# EAGLE design in14-4 (EAGLE 6.2)
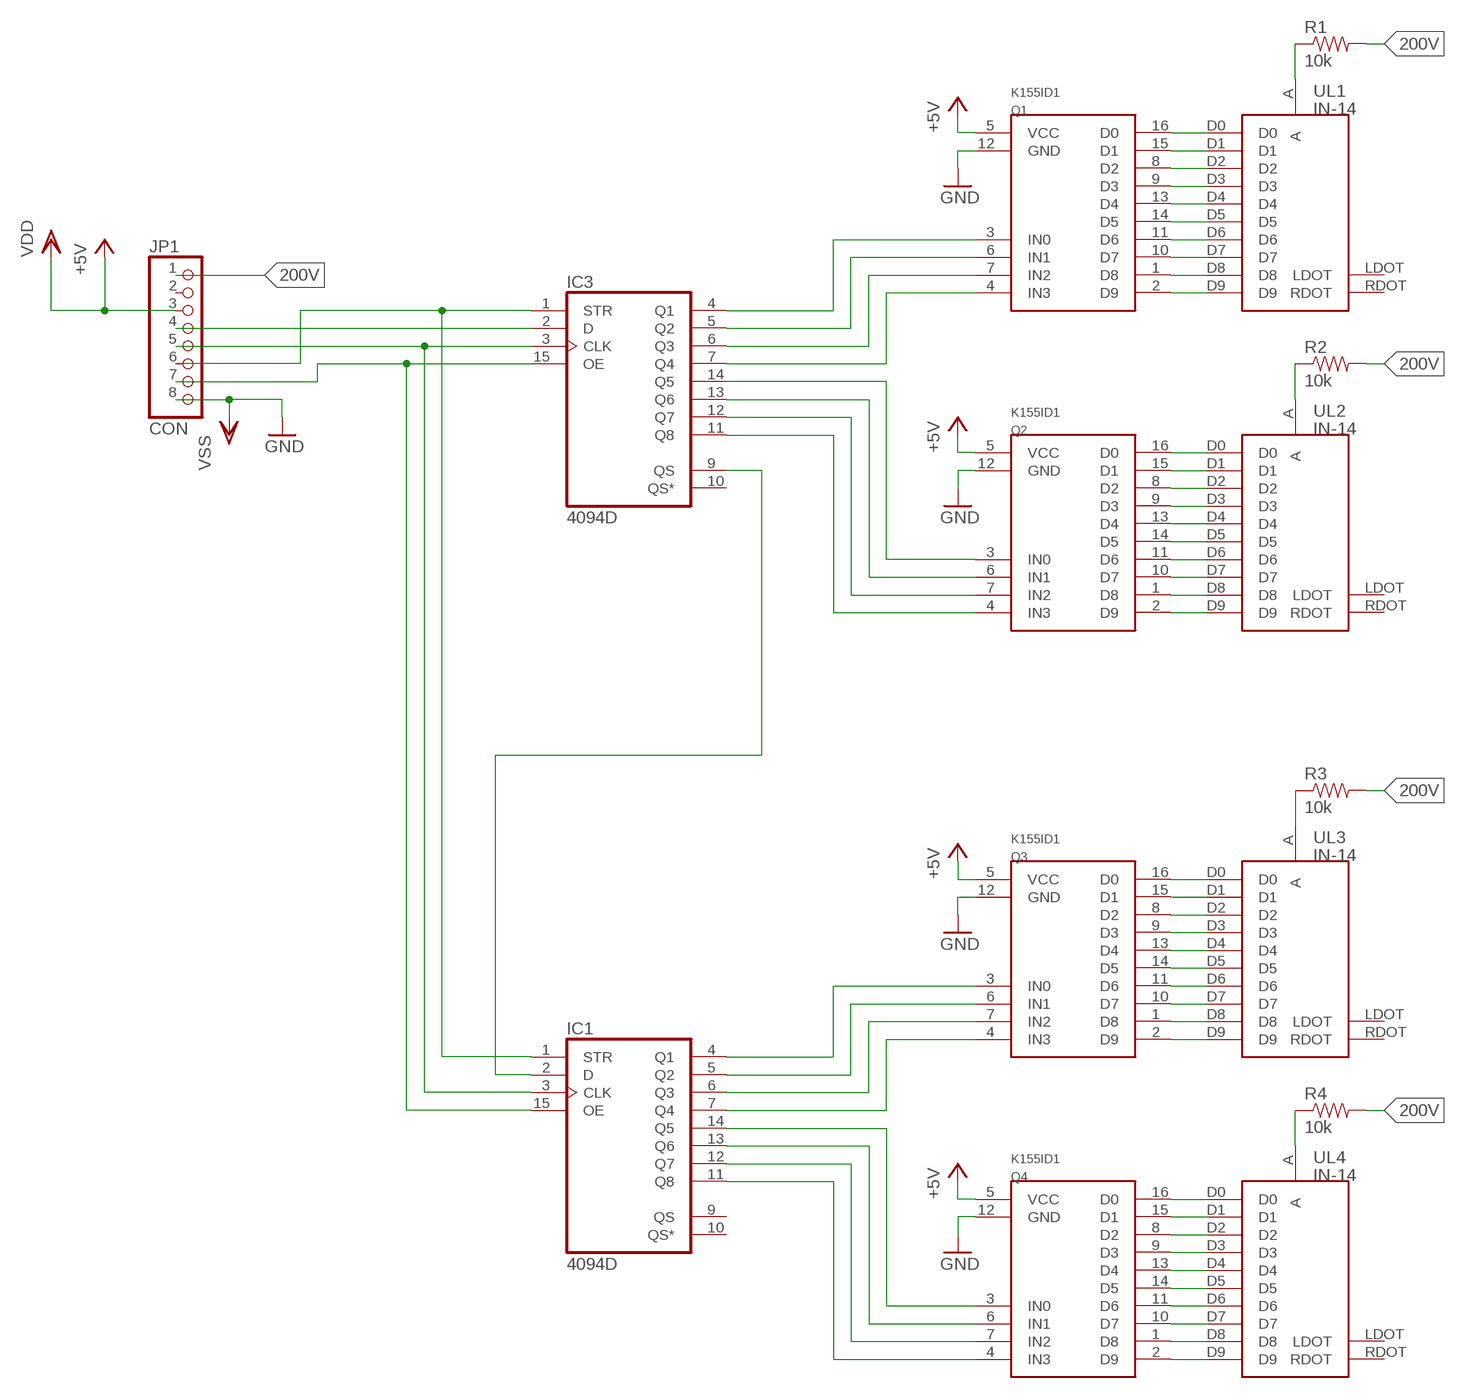
[diagram p0: schematic, sheet 1]

## Parts
IC1  4094D  [SO16]
IC3  4094D  [SO16]
JP1  CON  PINHD-1X8  [1X08]
Q1  K155ID1  [DIL16]
Q2  K155ID1  [DIL16]
Q3  K155ID1  [DIL16]
Q4  K155ID1  [DIL16]
R1  10k  RESISTOR1206  [1206]
R2  10k  RESISTOR1206  [1206]
R3  10k  RESISTOR1206  [1206]
R4  10k  RESISTOR1206  [1206]
UL1  IN-14  [IN-14]
UL2  IN-14  [IN-14]
UL3  IN-14  [IN-14]
UL4  IN-14  [IN-14]

## Nets
200V: JP1.1 R1.2 R2.2 R3.2 R4.2
+5V: JP1.3 Q1.5(VCC) Q2.5(VCC) Q3.5(VCC) Q4.5(VCC) ; supply symbol labelled VDD
GND: JP1.8 Q1.12(GND) Q2.12(GND) Q3.12(GND) Q4.12(GND) ; supply symbol labelled VSS
N$1: Q1.16(D0) UL1.D0
N$2: Q1.15(D1) UL1.D1
N$3: Q1.8(D2) UL1.D2
N$4: Q1.9(D3) UL1.D3
N$5: Q1.13(D4) UL1.D4
N$6: Q1.14(D5) UL1.D5
N$7: Q1.11(D6) UL1.D6
N$8: Q1.10(D7) UL1.D7
N$9: Q1.1(D8) UL1.D8
N$10: Q1.2(D9) UL1.D9
N$11: R1.1 UL1.A
N$12: Q2.16(D0) UL2.D0
N$13: Q2.15(D1) UL2.D1
N$14: Q2.8(D2) UL2.D2
N$15: Q2.9(D3) UL2.D3
N$16: Q2.13(D4) UL2.D4
N$17: Q2.14(D5) UL2.D5
N$18: Q2.11(D6) UL2.D6
N$19: Q2.10(D7) UL2.D7
N$20: Q2.1(D8) UL2.D8
N$21: Q2.2(D9) UL2.D9
N$22: R2.1 UL2.A
N$23: Q3.2(D9) UL3.D9
N$24: IC3.5(Q2) Q1.6(IN1)
N$25: Q3.11(D6) UL3.D6
N$28: IC3.13(Q6) Q2.6(IN1)
N$29: IC3.12(Q7) Q2.7(IN2)
N$30: IC3.11(Q8) Q2.4(IN3)
N$31: IC3.2(D) JP1.4
N$32: IC1.3(CLK) IC3.3(CLK) JP1.5
N$33: IC1.1(STR) IC3.1(STR) JP1.6
N$34: IC1.15(OE) IC3.15(OE) JP1.7
N$35: IC1.7(Q4) Q3.4(IN3)
N$36: IC1.6(Q3) Q3.7(IN2)
N$37: IC1.5(Q2) Q3.6(IN1)
N$38: IC1.4(Q1) Q3.3(IN0)
N$39: IC1.14(Q5) Q4.3(IN0)
N$40: IC1.13(Q6) Q4.6(IN1)
N$41: IC1.12(Q7) Q4.7(IN2)
N$42: IC1.11(Q8) Q4.4(IN3)
N$43: Q3.16(D0) UL3.D0
N$44: Q3.15(D1) UL3.D1
N$45: Q3.8(D2) UL3.D2
N$46: Q3.9(D3) UL3.D3
N$47: Q3.13(D4) UL3.D4
N$48: Q3.14(D5) UL3.D5
N$50: Q3.10(D7) UL3.D7
N$51: Q3.1(D8) UL3.D8
N$53: Q4.16(D0) UL4.D0
N$54: Q4.15(D1) UL4.D1
N$55: Q4.8(D2) UL4.D2
N$56: Q4.9(D3) UL4.D3
N$57: Q4.13(D4) UL4.D4
N$58: Q4.14(D5) UL4.D5
N$59: Q4.11(D6) UL4.D6
N$60: Q4.10(D7) UL4.D7
N$61: Q4.1(D8) UL4.D8
N$62: Q4.2(D9) UL4.D9
N$63: IC3.4(Q1) Q1.3(IN0)
N$64: R3.1 UL3.A
N$65: R4.1 UL4.A
N$67: IC1.2(D) IC3.9(QS)
N$68: IC3.7(Q4) Q1.4(IN3)
N$69: IC3.6(Q3) Q1.7(IN2)
N$70: IC3.14(Q5) Q2.3(IN0)
Unconnected: IC1.9(QS) IC1.10(QS*) IC3.10(QS*) JP1.2 UL1.LDOT UL1.RDOT UL2.LDOT UL2.RDOT UL3.LDOT UL3.RDOT UL4.LDOT UL4.RDOT

## Power pins joined to a net without a drawn wire
+5V: IC1.16(VDD) IC3.16(VDD)
GND: IC1.8(VSS) IC3.8(VSS)

## Library data of the parts
IC1 IC3 = 40xx:4094: 8-stage SHIFT/STORE REGISTER, tri-state
JP1 = pinhead:PINHD-1X8: PIN HEADER
Q1-Q4 = nixie:K155ID1
R1-R4 = SparkFun-Passives:RESISTOR: Resistor Basic schematic elements and footprints for 0603, 1206, and PTH resistors.
UL1-UL4 = nixie:IN-14

## Board
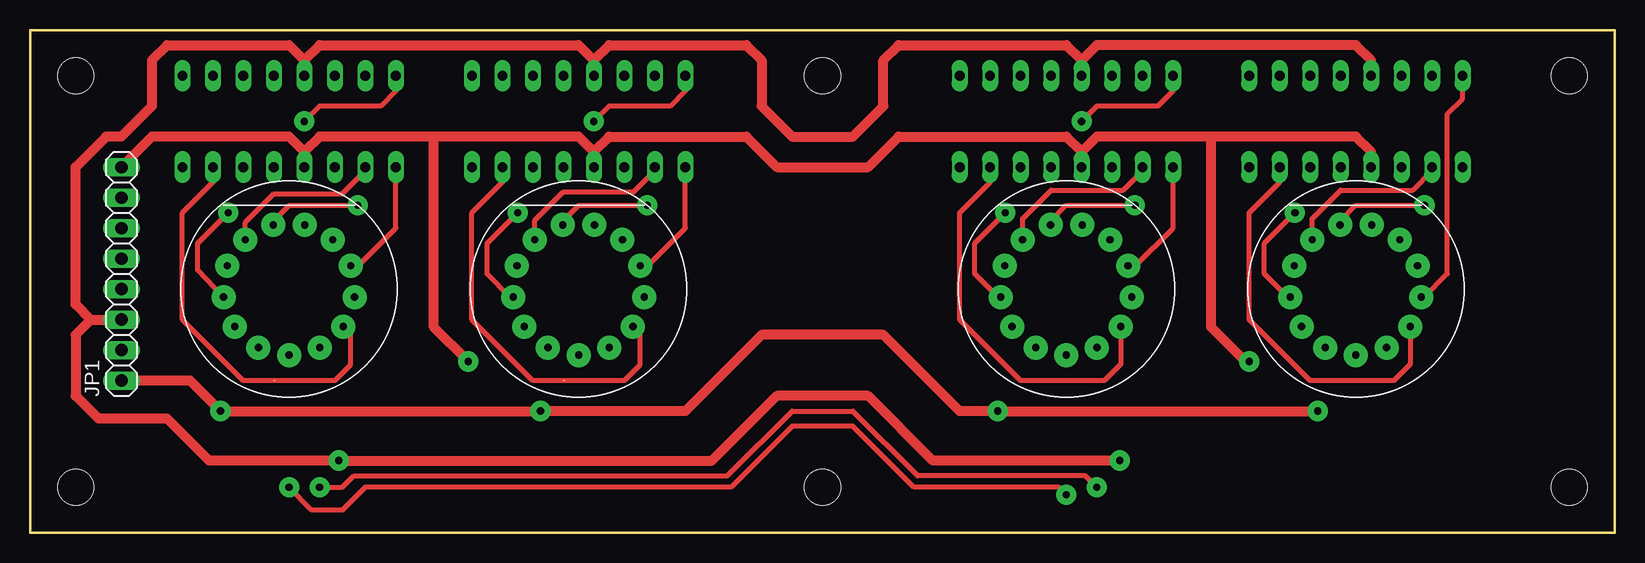
[diagram p1: board, top side]
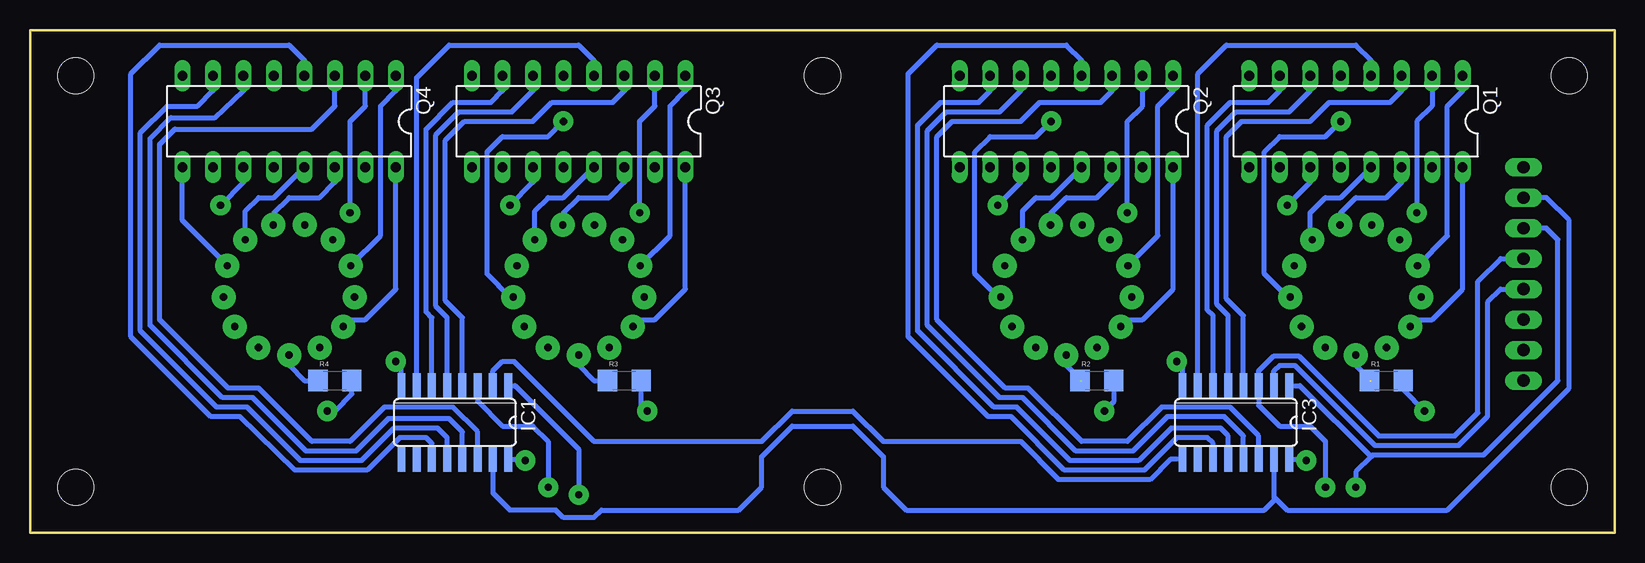
[diagram p2: board, bottom side, seen from below]

Size 132.08 x 41.91 mm. Coordinates in mm from the lower left corner, seen from the top.
Outline: 0,0 132.08,0 132.08,41.91 0,41.91 0,0
Copper layers (1*16): Top 0.035mm / dielectric 1.5mm / Bottom 0.035mm
Design rules: minimum track width 10mil, minimum drill 24mil, track to track 8mil, track to pad 8mil, pad to pad 8mil, via to via 8mil, smd to smd 8mil, copper to edge 40mil, drill to drill 8mil, minimum pad ring 10mil, minimum via ring 8mil, stop-mask expansion 4mil, vias tented up to drill 0mil, thermal gap 10mil
Holes 3 mm at 3.81,38.1 128.27,38.1 128.27,3.81 3.81,3.81 66.04,38.1 66.04,3.81

### Footprints (pad centres in the part's own frame; a part is rotated, then mirrored left to right if it is on the bottom)
SO16 = smd 0.66 x 2.032: 1 -4.445,-3.073; 2 -3.175,-3.073; 3 -1.905,-3.073; 4 -0.635,-3.073; 5 0.635,-3.073; 6 1.905,-3.073; 7 3.175,-3.073; 8 4.445,-3.073; 9 4.445,3.073; 10 3.175,3.073; 11 1.905,3.073; 12 0.635,3.073; 13 -0.635,3.073; 14 -1.905,3.073; 15 -3.175,3.073; 16 -4.445,3.073
1X08 = drill 1.016 long: 1 -8.89,0; 2 -6.35,0; 3 -3.81,0; 4 -1.27,0; 5 1.27,0; 6 3.81,0; 7 6.35,0; 8 8.89,0
DIL16 = drill 0.813 long: 1 -8.89,-3.81; 2 -6.35,-3.81; 3 -3.81,-3.81; 4 -1.27,-3.81; 5 1.27,-3.81; 6 3.81,-3.81; 7 6.35,-3.81; 8 8.89,-3.81; 9 8.89,3.81; 10 6.35,3.81; 11 3.81,3.81; 12 1.27,3.81; 13 -1.27,3.81; 14 -3.81,3.81; 15 -6.35,3.81; 16 -8.89,3.81
1206 = smd 1.6 x 1.8: 1 -1.4,0; 2 1.4,0
IN-14 = drill 0.6 pad 2: A 0,5.5; D0 4.526,3.124; D1 -4.526,3.124; D2 -5.46,0.663; D3 -5.143,-1.95; D4 -3.647,-4.117; D5 -1.316,-5.34; D6 1.316,-5.34; D7 3.647,-4.117; D8 5.143,-1.95; D9 5.46,0.663; LDOT -2.556,4.87; RDOT 2.556,4.87

### Placement (x,y rotation side)
IC1  96.68,9.21 180 bottom
IC3  31.59,9.21 180 bottom
JP1  7.62,21.59 90 top
Q1  21.59,34.29 180 bottom
Q2  45.72,34.29 180 bottom
Q3  86.36,34.29 180 bottom
Q4  110.49,34.29 180 bottom
R1  19.05,12.7 0 bottom
R2  43.18,12.7 0 bottom
R3  82.55,12.7 0 bottom
R4  106.68,12.7 0 bottom
UL1  21.59,20.32 180 top
UL2  45.72,20.32 180 top
UL3  86.36,20.32 180 top
UL4  110.49,20.32 180 top

### Tracks (layer width: path | path; a pad name or v marks a point on that pad's centre or on a via)
200V  (via drill 0.6 pad 1.68)
  Top 0.813: v107.31,10.16 v80.64,10.16 77.47,10.16 71.12,16.51 60.96,16.51 54.61,10.16 v42.55,10.16 v15.88,10.16 13.34,12.7 JP1.1
  Bottom 0.406: 16.36,10.64 v15.88,10.16 17.65,11.94 R1.2 | v80.64,10.16 81.13,10.64 81.15,10.64 R3.2 | v107.31,10.16 106.68,10.16 105.26,11.58 105.28,11.58 R4.2 | R2.2 41.78,10.93 v42.55,10.16
+5V  (via drill 0.6 pad 1.68)
  Top 0.813: Q1.5 22.86,39.37 | 22.86,39.37 24.13,40.64 45.72,40.64 46.99,39.37 | 46.99,39.37 Q2.5 | Q3.5 87.63,39.37 | 87.63,39.37 86.36,40.64 72.39,40.64 71.12,39.37 71.12,35.56 68.58,33.02 63.5,33.02 60.96,35.56 60.96,39.37 59.69,40.64 48.26,40.64 46.99,39.37 | Q4.5 111.76,39.37 110.49,40.64 88.9,40.64 87.63,39.37 | 5.08,17.78 3.81,19.05 3.81,30.48 6.35,33.02 7.62,33.02 10.16,35.56 10.16,39.37 11.43,40.64 21.59,40.64 22.86,39.37 | 5.08,17.78 3.81,16.51 3.81,11.43 5.71,9.53 11.43,9.53 14.92,6.03 v25.72,6.03 56.83,6.03 62.23,11.43 69.85,11.43 75.25,6.03 v90.81,6.03 | 5.08,17.78 JP1.3
  Bottom 0.406: IC3.16 25.82,6.13 v25.72,6.03 | IC1.16 90.91,6.13 v90.81,6.03
GND  (via drill 0.6 pad 1.68)
  Top 0.813: 22.86,31.75 21.59,33.02 10.16,33.02 JP1.8 | 22.86,31.75 Q1.12 | Q2.12 46.99,31.75 | 46.99,31.75 45.72,33.02 33.66,33.02 | 33.66,33.02 24.13,33.02 22.86,31.75 | Q3.12 87.63,31.75 | 87.63,31.75 86.36,33.02 72.39,33.02 69.85,30.48 62.23,30.48 59.69,33.02 48.26,33.02 46.99,31.75 | v36.51,14.29 33.66,17.14 33.66,33.02 | Q4.12 111.76,31.75 110.49,33.02 98.42,33.02 | 98.42,33.02 88.9,33.02 87.63,31.75 | v101.6,14.29 101.28,14.29 98.42,17.14 98.42,33.02
  Bottom 0.406: IC1.8 101.12,13.81 v101.6,14.29 | IC3.8 36.04,13.81 v36.51,14.29
N$1
  Bottom 0.406: UL1.D0 16.48,17.78 15.24,17.78 12.7,20.32 Q1.16
N$2
  Top 0.406: UL1.D1 26.67,16.64 26.67,13.97 25.4,12.7 17.78,12.7 12.7,17.78 12.7,26.67 15.24,29.21 Q1.15
N$3  (via drill 0.6 pad 1.68)
  Top 0.406: Q1.8 30.48,36.83 29.21,35.56 24.13,35.56 v22.86,34.29
  Bottom 0.406: UL1.D2 27.28,19.66 29.21,21.59 29.21,31.75 27.94,33.02 24.13,33.02 v22.86,34.29
N$4
  Top 0.406: UL1.D3 27.35,22.27 30.48,25.4 Q1.9
N$5
  Bottom 0.406: UL1.D4 25.4,24.6 25.4,26.67 24.13,27.94 22.86,27.94 Q1.13
N$6
  Bottom 0.406: UL1.D5 22.86,25.71 22.86,26.67 21.59,27.94 19.05,27.94 17.78,29.21 Q1.14
N$7  (via drill 0.6 pad 1.68)
  Top 0.406: UL1.D6 20.27,25.99 21.59,27.3 v27.3,27.3
  Bottom 0.406: Q1.11 25.4,29.21 v27.3,27.3
N$8
  Top 0.406: UL1.D7 17.94,25.88 20.32,28.26 26.04,28.26 27.94,30.16 Q1.10
N$9
  Bottom 0.406: UL1.D8 13.97,24.75 13.97,35.56 12.7,36.83 Q1.1
N$10  (via drill 0.6 pad 1.68)
  Top 0.406: UL1.D9 13.97,21.93 13.97,22.86 13.97,24.13 v16.51,26.67
  Bottom 0.406: Q1.2 15.24,35.56 16.51,34.29 v16.51,26.67
N$11  (1 unrouted)
  Bottom 0.406: UL1.A 21.59,13.97 20.32,12.7
N$12
  Bottom 0.406: UL2.D0 41.19,17.23 40.64,17.78 39.37,17.78 36.83,20.32 Q2.16
N$13
  Top 0.406: UL2.D1 50.25,17.06 50.8,16.51 50.8,13.97 49.53,12.7 41.91,12.7 36.83,17.78 36.83,26.67 39.37,29.21 Q2.15
N$14  (via drill 0.6 pad 1.68)
  Top 0.406: Q2.8 54.61,36.83 53.34,35.56 48.26,35.56 v46.99,34.29
  Bottom 0.406: UL2.D2 51.41,19.66 53.34,21.59 53.34,31.75 52.07,33.02 48.26,33.02 v46.99,34.29
N$15
  Top 0.406: UL2.D3 51.48,22.27 54.61,25.4 Q2.9
N$16
  Bottom 0.406: UL2.D4 49.37,26.83 48.26,27.94 46.99,27.94 Q2.13
N$17
  Bottom 0.406: UL2.D5 47.04,26.62 45.72,27.94 43.18,27.94 41.91,29.21 Q2.14
N$18  (via drill 0.6 pad 1.68)
  Top 0.406: UL2.D6 44.4,25.99 45.72,27.3 v51.44,27.3
  Bottom 0.406: Q2.11 49.53,29.21 v51.44,27.3
N$19
  Top 0.406: UL2.D7 42.07,26.04 44.45,28.42 50.32,28.42 52.07,30.16 Q2.10
N$20
  Bottom 0.406: UL2.D8 40.58,22.29 38.1,24.77 38.1,35.56 36.83,36.83 Q2.1
N$21  (via drill 0.6 pad 1.68)
  Top 0.406: UL2.D9 40.03,19.66 38.1,21.59 38.1,24.13 v40.64,26.67
  Bottom 0.406: v40.64,26.67 40.64,34.29 39.37,35.56 Q2.2
N$22  (1 unrouted)
  Bottom 0.406: UL2.A 45.72,13.97 44.45,12.7
N$23  (via drill 0.6 pad 1.68)
  Top 0.406: UL3.D9 80.67,19.66 78.74,21.59 78.74,24.13 v81.28,26.67
  Bottom 0.406: v81.28,26.67 81.28,34.29 80.01,35.56 Q3.2
N$24
  Bottom 0.406: IC3.5 32.23,18.1 33.18,19.05 33.18,33.5 31.59,35.08 27.15,35.08 25.4,36.83 Q1.6
N$25  (via drill 0.6 pad 1.68)
  Top 0.406: UL3.D6 85.04,25.99 86.36,27.3 v92.08,27.3
  Bottom 0.406: v92.08,27.3 90.17,29.21 Q3.11
N$28
  Bottom 0.406: IC3.13 30.96,8.1 32.54,9.68 37.31,9.68 40.16,6.83 44.93,6.83 49.37,11.27 51.28,11.27 57.31,17.3 57.31,33.5 55.72,35.08 51.28,35.08 49.53,36.83 Q2.6
N$29
  Bottom 0.406: IC3.12 32.23,8.1 32.86,8.73 36.99,8.73 39.69,6.03 45.4,6.03 49.85,10.48 51.75,10.48 58.1,16.83 58.1,33.97 56.2,35.88 53.02,35.88 52.07,36.83 Q2.7
N$30
  Bottom 0.406: IC3.11 33.5,7.46 33.97,7.94 36.51,7.94 39.21,5.24 45.88,5.24 50.32,9.68 52.23,9.68 58.9,16.35 58.9,38.26 56.52,40.64 45.72,40.64 44.45,39.37 Q2.4
N$31
  Bottom 0.406: IC3.2 28.42,13.49 27.94,13.97 26.67,13.97 20,7.3 13.02,7.3 10.64,9.68 10.64,19.21 9.53,20.32 JP1.4
N$32  (via drill 0.6 pad 1.68)
  Top 0.406: v24.13,3.81 26.04,3.81 26.99,4.76 58.1,4.76 63.5,10.16 68.58,10.16 73.98,4.76 87.95,4.76 v88.9,3.81
  Bottom 0.406: v24.13,3.81 24.13,7.62 25.4,8.89 27.94,8.89 29.69,10.64 IC3.3 29.69,13.49 28.42,14.76 26.35,14.76 19.68,8.1 13.34,8.1 11.43,10 11.43,20.95 9.53,22.86 JP1.5 | IC1.3 94.77,10.95 92.71,8.89 90.17,8.89 88.9,7.62 v88.9,3.81
N$33  (via drill 0.6 pad 1.68)
  Top 0.406: v86.36,3.17 85.72,3.81 73.66,3.81 68.58,8.89 63.5,8.89 58.42,3.81 27.94,3.81 26.04,1.91 23.5,1.91 v21.59,3.81
  Bottom 0.406: 20.32,6.35 20.16,6.51 10.95,6.51 4.76,12.7 4.76,24.45 5.71,25.4 JP1.6 | 20.32,6.35 21.59,5.08 v21.59,3.81 | IC3.1 26.25,12.28 20.32,6.35 | IC1.1 91.66,12.28 86.36,6.99 v86.36,3.17
N$34
  Bottom 0.406: IC3.15 28.42,3.02 | 28.42,3.02 27.3,1.91 13.97,1.91 3.81,12.06 3.81,26.04 5.71,27.94 JP1.7 | IC1.15 93.5,3.33 92.08,1.91 88.27,1.91 87.63,1.27 85.09,1.27 84.45,1.91 73.03,1.91 71.12,3.81 71.12,6.35 68.58,8.89 63.5,8.89 60.96,6.35 60.96,3.81 59.05,1.91 29.21,1.91 28.42,2.7 28.42,3.02
N$35
  Bottom 0.406: IC1.7 99.85,37.94 97.16,40.64 86.36,40.64 85.09,39.37 Q3.4
N$36
  Bottom 0.406: IC1.6 98.58,17.94 99.06,18.41 99.06,33.66 96.84,35.88 93.66,35.88 92.71,36.83 Q3.7
N$37
  Bottom 0.406: IC1.5 97.31,17.94 98.27,18.89 98.27,33.18 96.36,35.08 91.92,35.08 90.17,36.83 Q3.6
N$38
  Bottom 0.406: IC1.4 96.04,17.94 97.47,19.37 97.47,32.7 95.89,34.29 90.17,34.29 88.58,35.88 83.5,35.88 82.55,36.83 Q3.3
N$39
  Bottom 0.406: Q4.3 106.68,35.56 108.58,33.66 120.02,33.66 121.28,32.38 121.28,17.78 115.57,12.06 113.03,12.06 108.58,7.62 105.41,7.62 102.55,10.48 96.84,10.48 94.77,8.41 IC1.14
N$40
  Bottom 0.406: Q4.6 114.3,36.83 116.68,34.61 120.33,34.61 122.08,32.86 122.08,17.3 116.05,11.27 113.51,11.27 109.06,6.83 104.93,6.83 102.23,9.53 97.16,9.53 96.04,8.41 IC1.13
N$41
  Bottom 0.406: Q4.7 116.84,36.83 118.11,35.56 120.65,35.56 122.87,33.34 122.87,16.83 116.52,10.48 113.98,10.48 109.54,6.03 104.46,6.03 101.76,8.73 98.11,8.73 97.31,7.94 IC1.12
N$42
  Bottom 0.406: Q4.4 109.22,39.37 110.49,40.64 121.28,40.64 123.67,38.26 123.67,16.35 117,9.68 114.62,9.68 110.01,5.24 103.98,5.24 101.28,7.94 99.06,7.94 98.58,7.46 IC1.11
N$43
  Bottom 0.406: UL3.D0 81.83,17.23 81.28,17.78 80.01,17.78 77.47,20.32 Q3.16
N$44
  Top 0.406: UL3.D1 90.89,14.05 89.53,12.7 82.55,12.7 77.47,17.78 77.47,26.67 80.01,29.21 Q3.15
N$45  (via drill 0.6 pad 1.68)
  Top 0.406: Q3.8 95.25,36.83 93.98,35.56 88.9,35.56 v87.63,34.29
  Bottom 0.406: UL3.D2 92.05,19.66 93.98,21.59 93.98,31.75 92.71,33.02 88.9,33.02 v87.63,34.29
N$46
  Top 0.406: UL3.D3 92.12,22.27 95.25,25.4 Q3.9
N$47
  Bottom 0.406: UL3.D4 90.01,26.83 88.9,27.94 87.63,27.94 Q3.13
N$48
  Bottom 0.406: UL3.D5 87.68,26.62 86.36,27.94 83.82,27.94 82.55,29.21 Q3.14
N$50
  Top 0.406: UL3.D7 82.71,26.2 85.09,28.57 91.12,28.57 92.71,30.16 Q3.10
N$51
  Bottom 0.406: UL3.D8 81.22,22.29 78.74,24.77 78.74,35.56 77.47,36.83 Q3.1
N$53
  Bottom 0.406: UL4.D0 105.96,17.23 105.41,17.78 104.14,17.78 101.6,20.32 Q4.16
N$54
  Top 0.406: UL4.D1 115.02,14.05 113.67,12.7 106.68,12.7 101.6,17.78 101.6,26.67 104.14,29.21 Q4.15
N$55
  Top 0.406: UL4.D2 116.18,19.66 118.11,21.59 118.11,34.92 119.38,36.2 Q4.8
N$56
  Bottom 0.406: UL4.D3 115.63,22.29 119.38,26.04 Q4.9
N$57
  Bottom 0.406: UL4.D4 114.14,26.83 113.03,27.94 111.76,27.94 Q4.13
N$58
  Bottom 0.406: UL4.D5 111.81,26.62 110.49,27.94 107.95,27.94 106.68,29.21 Q4.14
N$59  (via drill 0.6 pad 1.68)
  Top 0.406: UL4.D6 109.17,25.99 110.49,27.3 v116.2,27.3
  Bottom 0.406: Q4.11 114.3,29.21 v116.2,27.3
N$60
  Top 0.406: UL4.D7 106.84,26.2 109.22,28.57 115.25,28.57 116.84,30.16 Q4.10
N$61
  Bottom 0.406: UL4.D8 105.35,22.29 102.87,24.77 102.87,35.56 101.6,36.83 Q4.1
N$62  (via drill 0.6 pad 1.68)
  Top 0.406: UL4.D9 104.8,19.66 102.87,21.59 102.87,24.13 v105.41,26.67
  Bottom 0.406: v105.41,26.67 105.41,34.29 104.14,35.56 Q4.2
N$63
  Bottom 0.406: IC3.4 30.96,18.1 32.38,19.53 32.38,33.02 31.11,34.29 25.4,34.29 23.81,35.88 18.73,35.88 17.78,36.83 Q1.3
N$64
  Bottom 0.406: UL3.A 86.36,13.97 85.09,12.7 R3.1
N$65
  Bottom 0.406: UL4.A 110.49,13.97 109.22,12.7 R4.1 107.95,12.7
N$67
  Bottom 0.406: IC3.9 37.05,6.13 38.73,4.45 46.35,4.45 49.53,7.62 60.96,7.62 63.5,10.16 68.58,10.16 71.12,7.62 85.09,7.62 91.76,14.29 92.71,14.29 93.5,13.49 IC1.2
N$68
  Bottom 0.406: IC3.7 34.77,38.26 32.38,40.64 21.59,40.64 20.32,39.37 Q1.4
N$69
  Bottom 0.406: IC3.6 33.5,18.1 33.97,18.57 33.97,33.97 32.07,35.88 28.89,35.88 27.94,36.83 Q1.7
N$70
  Bottom 0.406: IC3.14 29.69,8.1 32.07,10.48 37.78,10.48 40.64,7.62 44.45,7.62 48.9,12.06 50.8,12.06 56.52,17.78 56.52,33.02 55.24,34.29 49.53,34.29 47.94,35.88 42.86,35.88 41.91,36.83 Q2.3